# EAGLE design BrushlessMotorController (EAGLE 9.6.2)
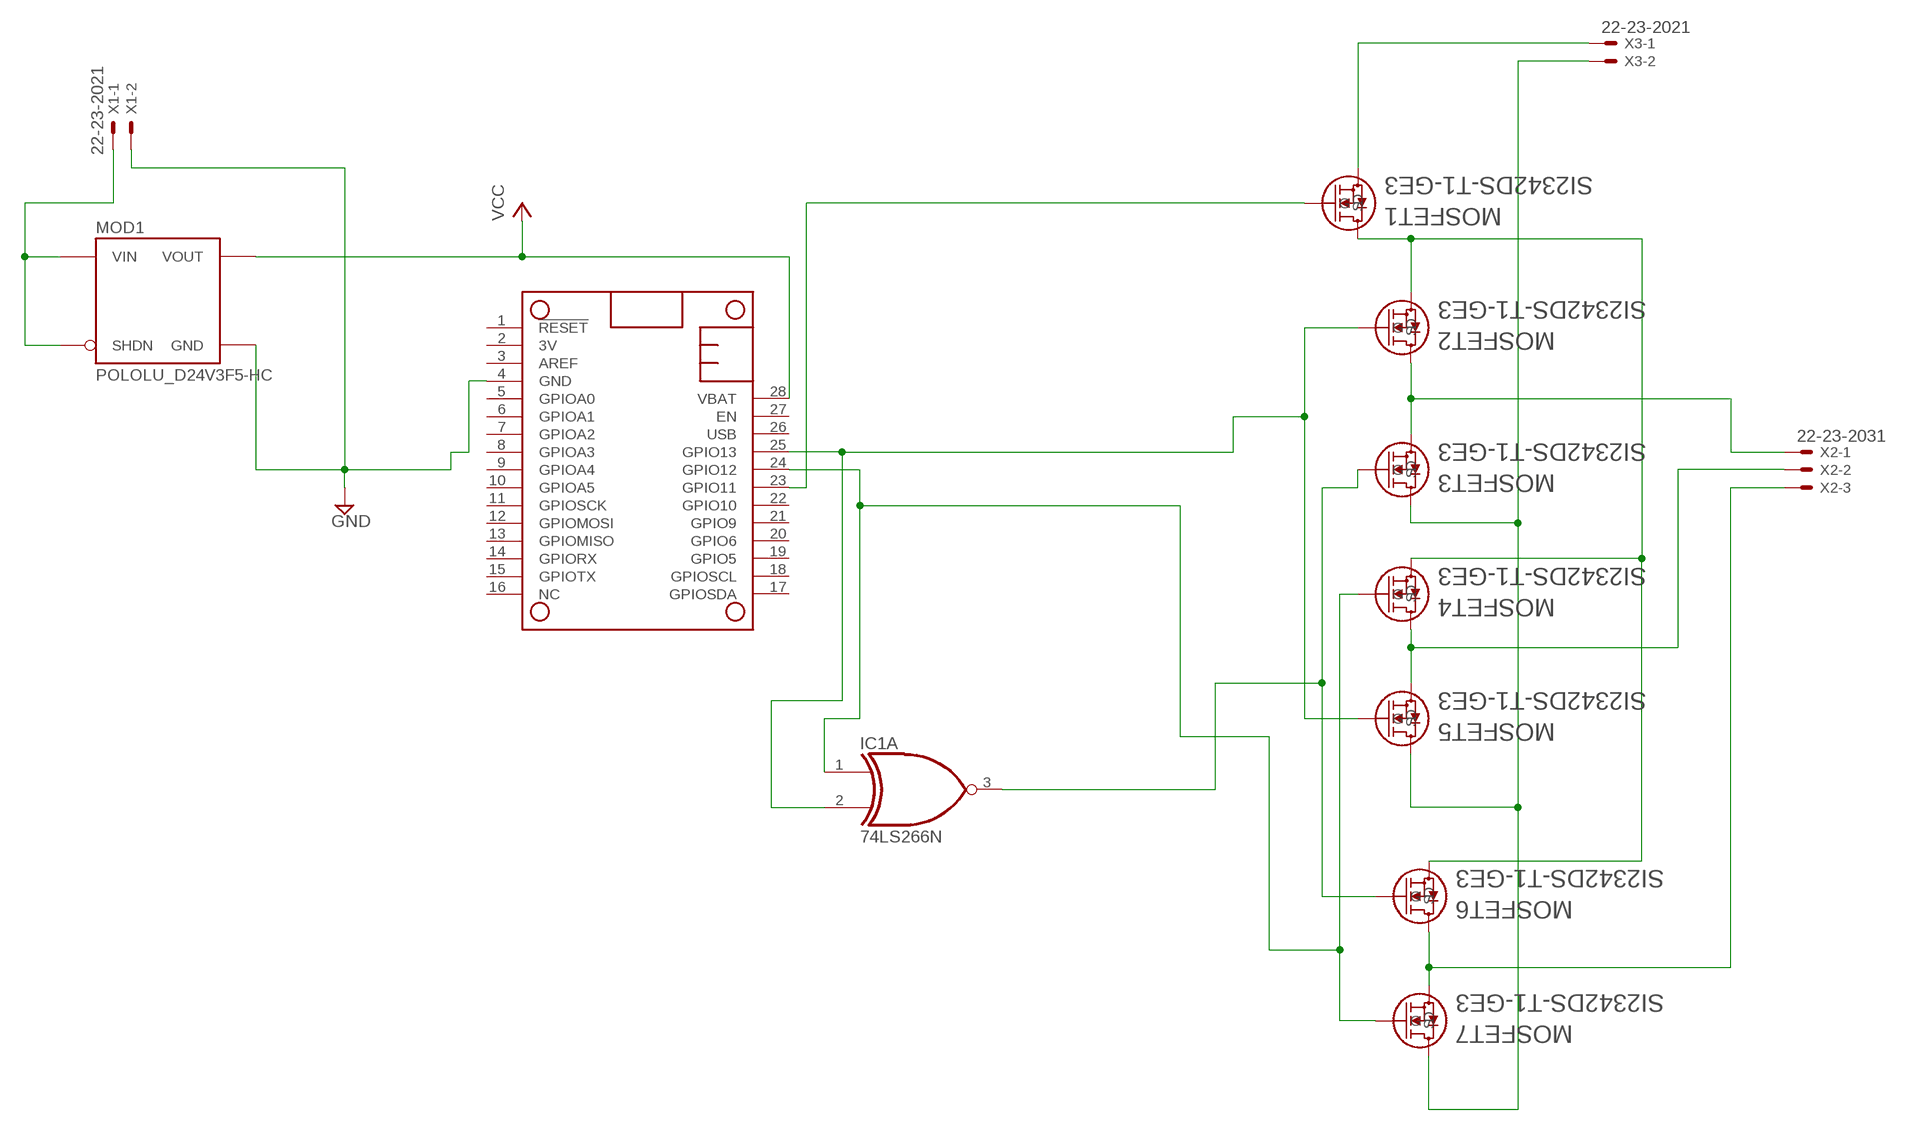
[diagram p0: schematic, sheet 1]

## Parts
IC1  74LS266N  [DIL14]
MOD1  POLOLU_D24V3F5-HC  [POLOLU_D24V3F_HC]
MOSFET1  SI2342DS-T1-GE3  [SOT-23_TO-236_VIS]
MOSFET2  SI2342DS-T1-GE3  [SOT-23_TO-236_VIS]
MOSFET3  SI2342DS-T1-GE3  [SOT-23_TO-236_VIS]
MOSFET4  SI2342DS-T1-GE3  [SOT-23_TO-236_VIS]
MOSFET5  SI2342DS-T1-GE3  [SOT-23_TO-236_VIS]
MOSFET6  SI2342DS-T1-GE3  [SOT-23_TO-236_VIS]
MOSFET7  SI2342DS-T1-GE3  [SOT-23_TO-236_VIS]
MS2  FEATHERWING_NODIM  [FEATHERWING_DIM]
X1  22-23-2021  [22-23-2021]
X2  22-23-2031  [22-23-2031]
X3  22-23-2021  [22-23-2021]

## Nets
GND: MOD1.G(GND) MS2.4(GND) X1.2
N$1: IC1.2(A:I1) MOSFET2.1(G) MOSFET5.1(G) MS2.25(GPIO13)
N$2: IC1.1(A:I0) MOSFET4.1(G) MOSFET7.1(G) MS2.24(GPIO12)
N$3: MOSFET1.2(S) X3.1
N$4: MOSFET1.1(G) MS2.23(GPIO11)
N$5: MOD1.I(VIN) MOD1.S(SHDN) X1.1
N$6: MOSFET3.3(D) MOSFET5.3(D) MOSFET7.3(D) X3.2
N$7: MOSFET1.3(D) MOSFET2.2(S) MOSFET4.2(S) MOSFET6.2(S)
N$8: MOSFET2.3(D) MOSFET3.2(S) X2.1
N$9: MOSFET4.3(D) MOSFET5.2(S) X2.2
N$10: MOSFET6.3(D) MOSFET7.2(S) X2.3
N$13: IC1.3(A:O) MOSFET3.1(G) MOSFET6.1(G)
VCC: MOD1.O(VOUT) MS2.28(VBAT)
Unconnected: IC1.4(B:O) IC1.5(B:I0) IC1.6(B:I1) IC1.8(C:I0) IC1.9(C:I1) IC1.10(C:O) IC1.11(D:O) IC1.12(D:I0) IC1.13(D:I1) MS2.1(!RESET) MS2.2(3V) MS2.3(AREF) MS2.5(GPIOA0) MS2.6(GPIOA1) MS2.7(GPIOA2) MS2.8(GPIOA3) MS2.9(GPIOA4) MS2.10(GPIOA5) MS2.11(GPIOSCK) MS2.12(GPIOMOSI) MS2.13(GPIOMISO) MS2.14(GPIORX) MS2.15(GPIOTX) MS2.16(NC) MS2.17(GPIOSDA) MS2.18(GPIOSCL) MS2.19(GPIO5) MS2.20(GPIO6) MS2.21(GPIO9) MS2.22(GPIO10) MS2.26(USB) MS2.27(EN)

## Power pins joined to a net without a drawn wire
GND: IC1.7(P:GND)
VCC: IC1.14(P:VCC)

## Library data of the parts
IC1 = 74xx-us:74*266: Quadruple EXCLUSIVE-NOR (XNOR), open-collector
MOD1 = _hhn_Pololu:POLOLU_D24V3F*: Pololu Step Down Voltage Regulators Series D24V3F_ (300 mA) 0.4"x0.5" SOURCE www.pololu.com/ PACKAGE THT; 4-pin (0.1"); 0.4"x0.5" TECHNOLOGIES D24V3F… Vo/V Vi/V (for max. Io) X: (generic) 3: 3.3 3.8 ( 4.3) … 42.0 5: 5.0 6.0 ( 6.5) … 42.0 9: 9.0 10.5 (12.5) … 42.0 12: 12.0 14.0 (17.5) … 42.0 Io: 300 mA; Quiescent Current: 2 mA (SHDN: 20 uA) Author: Dipl.-Ing. FH Rainer Bayer
MOSFET1-MOSFET7 = Import1:SI2342DS-T1-GE3; BUILT_BY: EMA_Cory; COPYRIGHT: Copyright (C) 2018 Accelerated Designs. All rights reserved; DATASHEET: http://www.vishay.com/docs/63302/si2342ds.pdf; MANUFACTURER_PART_NUMBER: SI2342DS-T1-GE3; SOURCELIBRARY: Vishay_2020-03-16; VENDOR: Vishay
MS2 = adafruit:FEATHERWING
X1 X3 = con-molex:22-23-2021: .100" (2.54mm) Center Header - 2 Pin; MF: MOLEX; MPN: 22-23-2021; OC_FARNELL: 1462926; OC_NEWARK: 25C3832
X2 = con-molex:22-23-2031: .100" (2.54mm) Center Header - 3 Pin; MF: MOLEX; MPN: 22-23-2031; OC_FARNELL: 1462950; OC_NEWARK: 30C0862

## Board
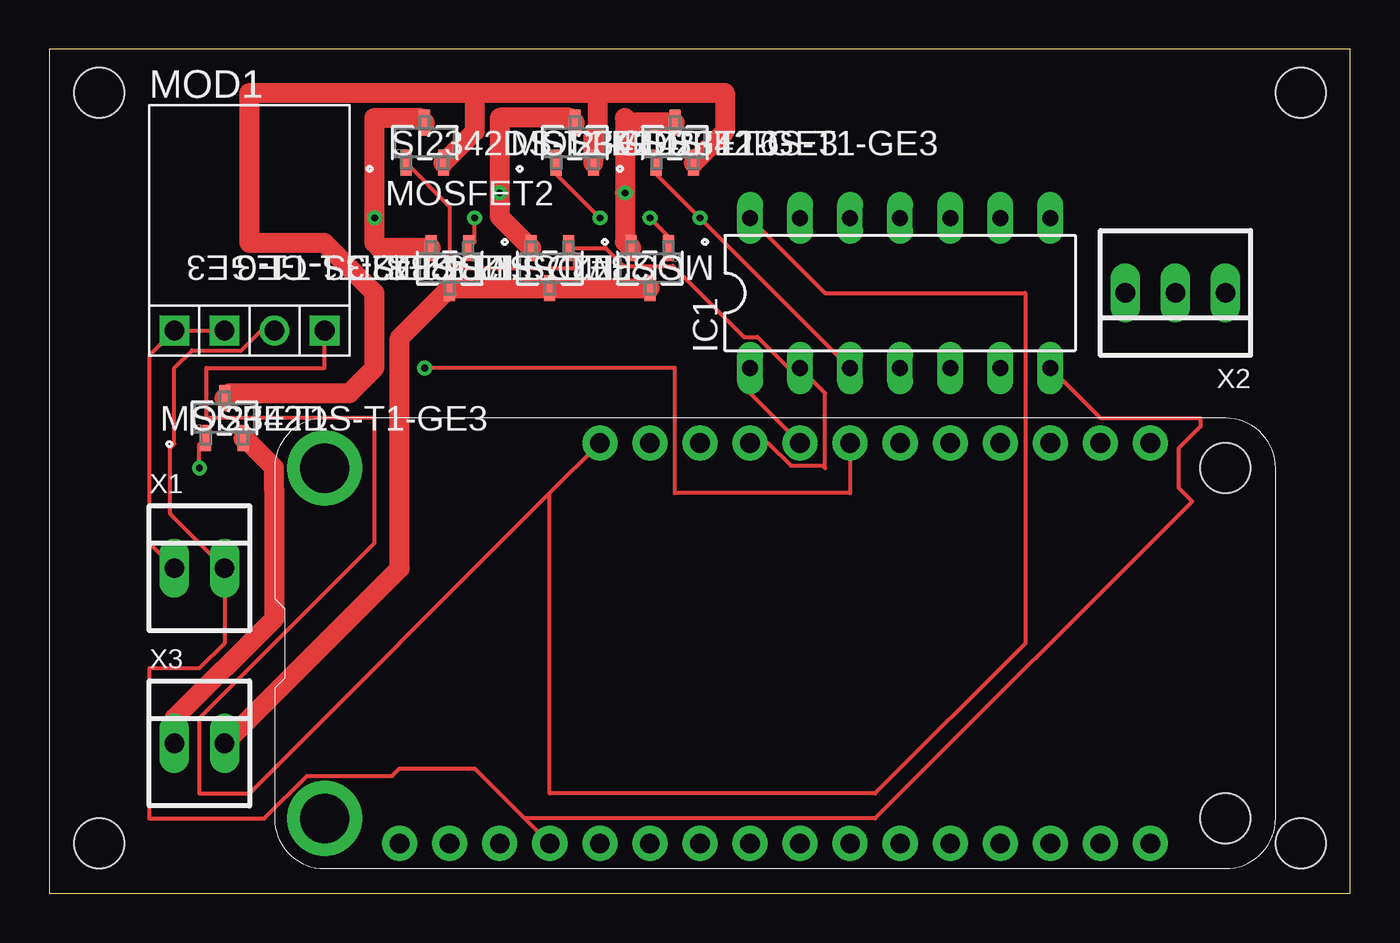
[diagram p1: board, top side]
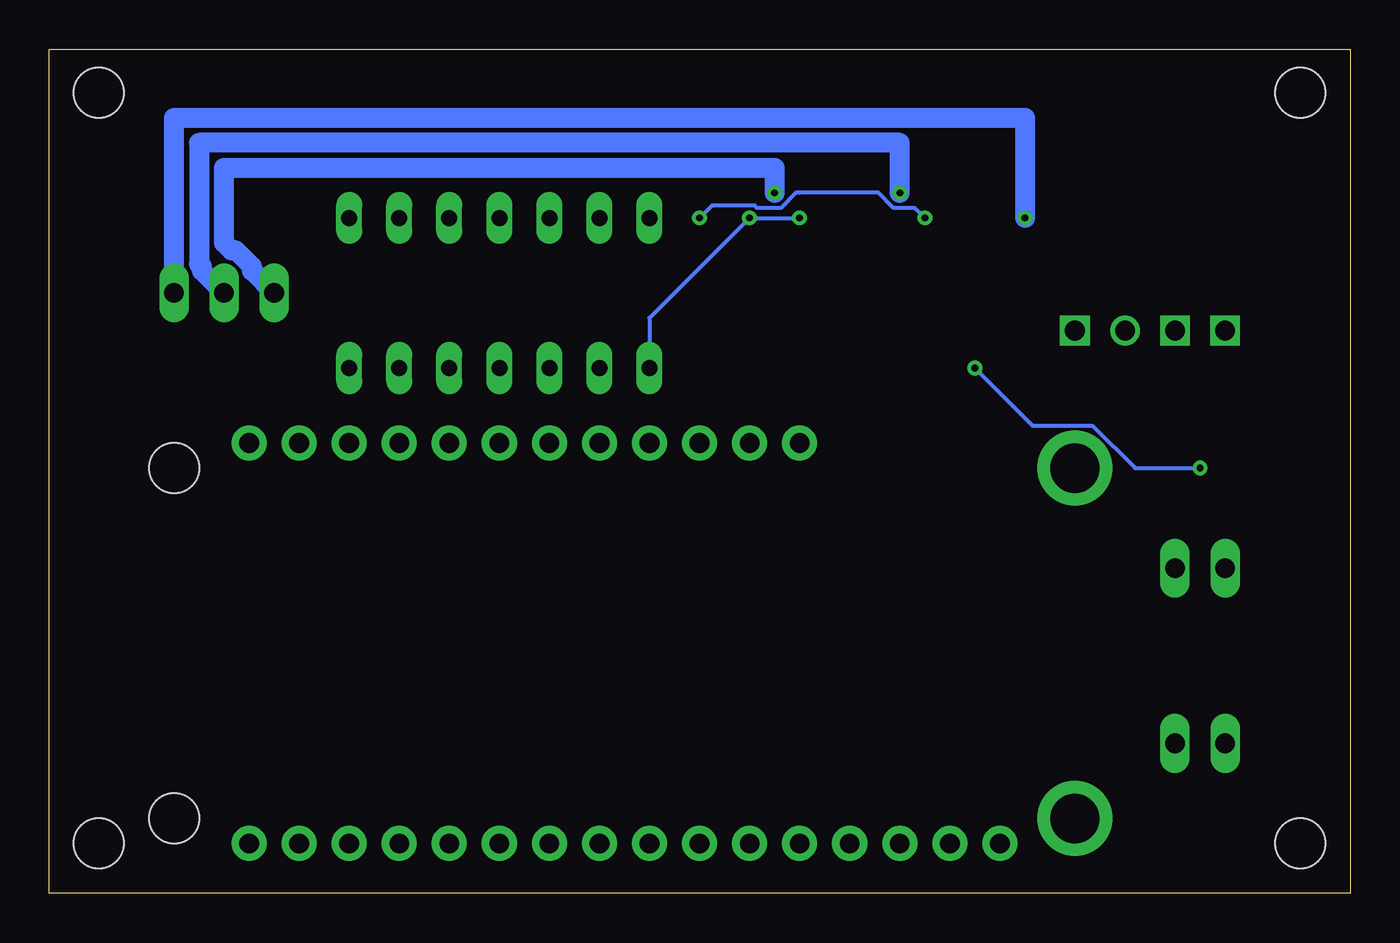
[diagram p2: board, bottom side, seen from below]

Size 66.02 x 42.85 mm. Coordinates in mm from the lower left corner, seen from the top.
Outline: 0,0 66.02,0 66.02,42.85 0,42.85 0,0
Copper layers (1*16): Top 0.035mm / dielectric 1.5mm / Bottom 0.035mm
Design rules "default": minimum track width 6mil, minimum drill 0.35mm, track to track 6mil, track to pad 6mil, pad to pad 6mil, via to via 6mil, smd to smd 6mil, copper to edge 40mil, drill to drill 6mil, minimum pad ring 10mil, minimum via ring 8mil, stop-mask expansion 4mil, vias tented up to drill 0mil, thermal gap 10mil
Holes 2.54 mm at 2.54,40.64 2.54,2.54 63.5,40.64 63.5,2.54

### Footprints (pad centres in the part's own frame; a part is rotated, then mirrored left to right if it is on the bottom)
DIL14 = drill 0.813 long: 1 -7.62,-3.81; 2 -5.08,-3.81; 3 -2.54,-3.81; 4 0,-3.81; 5 2.54,-3.81; 6 5.08,-3.81; 7 7.62,-3.81; 8 7.62,3.81; 9 5.08,3.81; 10 2.54,3.81; 11 0,3.81; 12 -2.54,3.81; 13 -5.08,3.81; 14 -7.62,3.81
POLOLU_D24V3F_HC = drill 1: G 1.27,-5.715 | drill 1 square: I -1.27,-5.715; O 3.81,-5.715; S -3.81,-5.715
SOT-23_TO-236_VIS = smd 0.559 x 1.321: 1 -0.95,-1.016; 2 0.95,-1.016; 3 0,1.016
FEATHERWING_DIM = drill 1 pad 1.778: 1 6.35,1.27; 2 8.89,1.27; 3 11.43,1.27; 4 13.97,1.27; 5 16.51,1.27; 6 19.05,1.27; 7 21.59,1.27; 8 24.13,1.27; 9 26.67,1.27; 10 29.21,1.27; 11 31.75,1.27; 12 34.29,1.27; 13 36.83,1.27; 14 39.37,1.27; 15 41.91,1.27; 16 44.45,1.27; 17 44.45,21.59; 18 41.91,21.59; 19 39.37,21.59; 20 36.83,21.59; 21 34.29,21.59; 22 31.75,21.59; 23 29.21,21.59; 24 26.67,21.59; 25 24.13,21.59; 26 21.59,21.59; 27 19.05,21.59; 28 16.51,21.59 | drill 2.5 pad 3.81: P$1 2.54,20.32; P$2 2.54,2.54 | hole 2.54: 48.26,20.32; 48.26,2.54
22-23-2021 = drill 1 long: 1 -1.27,0; 2 1.27,0
22-23-2031 = drill 1 long: 1 -2.54,0; 2 0,0; 3 2.54,0

### Placement (x,y rotation side)
IC1  43.18,30.48 0 top
MOD1  10.16,34.29 0 top
MOSFET1  8.89,24.13 0 top
MOSFET2  19.05,38.1 0 top
MOSFET3  20.32,31.75 180 top
MOSFET4  26.67,38.1 0 top
MOSFET5  25.4,31.75 180 top
MOSFET6  31.75,38.1 0 top
MOSFET7  30.48,31.75 180 top
MS2  11.43,1.27 0 top
X1  7.62,16.51 0 top
X2  57.15,30.48 180 top
X3  7.62,7.62 0 top

### Tracks (layer width: path | path; a pad name or v marks a point on that pad's centre or on a via)
GND
  Top 0.203: 24.13,3.81 21.59,6.35 17.78,6.35 17.4,5.97 13.08,5.97 10.92,3.81 5.08,3.81 5.08,11.43 7.62,11.43 8.89,12.7 X1.2 6.14,19.26 6.14,22.61 6.35,22.82 6.35,26.67 7.25,27.57 9.75,27.57 10.76,28.57 MOD1.G | 24.13,3.81 MS2.4 | IC1.7 53.34,24.13 58.42,24.13 58.42,23.7 57.3,22.58 57.3,20.6 58,19.9 41.91,3.81 24.13,3.81
N$1
  Top 0.203: MOSFET2.1 20.32,34.86 20.32,31.75 26.67,31.75 26.67,32.45 MOSFET5.1 28.23,32.77 29.14,31.85 31.65,31.85 35.26,28.25 35.94,28.25 37.51,26.67 IC1.2 39.37,25.4 39.37,21.59 39.24,21.72 37.63,21.72 36.48,22.86 MS2.25
N$2  (via drill 0.35)
  Top 0.203: MS2.24 35.56,25.4 IC1.1 | MOSFET7.1 31.43,33.34 v30.48,34.29 | v27.94,34.29 25.72,36.51 MOSFET4.1
  Bottom 0.203: IC1.1 35.56,29.21 v30.48,34.29 v27.94,34.29
N$3
  Top 1.016: X3.1 6.35,8.89 11.43,13.97 11.43,20.5 11.4,20.53 11.4,21.61 9.91,23.11 MOSFET1.2
N$4  (via drill 0.35)
  Top 0.203: MS2.23 40.64,20.32 31.75,20.32 31.75,26.67 v19.05,26.67 | v7.62,21.59 7.62,22.79 MOSFET1.1
  Bottom 0.203: v19.05,26.67 16.13,23.75 13.08,23.75 10.92,21.59 v7.62,21.59
N$5
  Top 0.203: X1.1 5.08,17.78 5.08,27.3 MOD1.S MOD1.I
N$6
  Top 1.016: X3.2 17.78,16.51 17.78,28.19 MOSFET3.3 MOSFET5.3 MOSFET7.3
N$7
  Top 1.016: MOSFET1.3 9.14,25.4 15.24,25.4 16.51,26.67 16.51,30.48 13.97,33.02 10.16,33.02 10.16,40.64 21.59,40.64 | 21.59,40.64 21.59,38.67 MOSFET2.2 | MOSFET6.2 34.29,38.67 34.29,40.64 27.94,40.64 | 21.59,40.64 27.94,40.64 | MOSFET4.2 27.62,38.41 27.84,38.63 27.84,40.54 27.94,40.64
N$8  (via drill 0.35)
  Top 1.016: MOSFET3.2 16.76,32.77 16.51,33.02 v16.51,34.29 16.51,39.37 18.8,39.37 MOSFET2.3
  Bottom 1.016: X2.1 59.69,39.37 16.51,39.37 v16.51,34.29
N$9  (via drill 0.35)
  Top 1.016: MOSFET4.3 26.42,39.37 22.86,39.37 v22.86,35.56 22.86,34.36 MOSFET5.2
  Bottom 1.016: v22.86,35.56 22.86,38.1 58.42,38.1 58.42,31.96 58.28,31.82 58.28,31.61 X2.2
N$10  (via drill 0.35)
  Top 1.016: MOSFET6.3 29.46,39.12 29.21,39.37 v29.21,35.56 29.21,33.09 MOSFET7.2
  Bottom 1.016: X2.3 55.74,31.61 55.74,31.82 56.56,32.65 56.78,32.65 57.15,33.02 57.15,36.83 29.21,36.83 v29.21,35.56
N$13  (via drill 0.35)
  Top 0.203: IC1.3 v33.02,34.29 30.8,36.51 MOSFET6.1 | 21.52,33.02 MOSFET3.1 21.59,33.09 v21.59,34.29
  Bottom 0.203: v21.59,34.29 22.1,34.8 23.18,34.8 23.94,35.56 27.94,35.56 28.13,35.56 28.89,34.8 30.09,34.8 30.22,34.92 30.48,34.92 32.39,34.92 v33.02,34.29
VCC
  Top 0.203: 25.4,20.32 10.16,5.08 7.62,5.08 7.62,8.89 16.51,17.78 16.51,24.13 7.98,24.13 7.98,26.67 13.97,26.67 MOD1.O | 25.4,20.32 MS2.28 | IC1.14 39.37,30.48 49.53,30.48 49.53,12.7 41.91,5.08 25.4,5.08 25.4,20.32